# Altium project LED Driver.PrjPcb
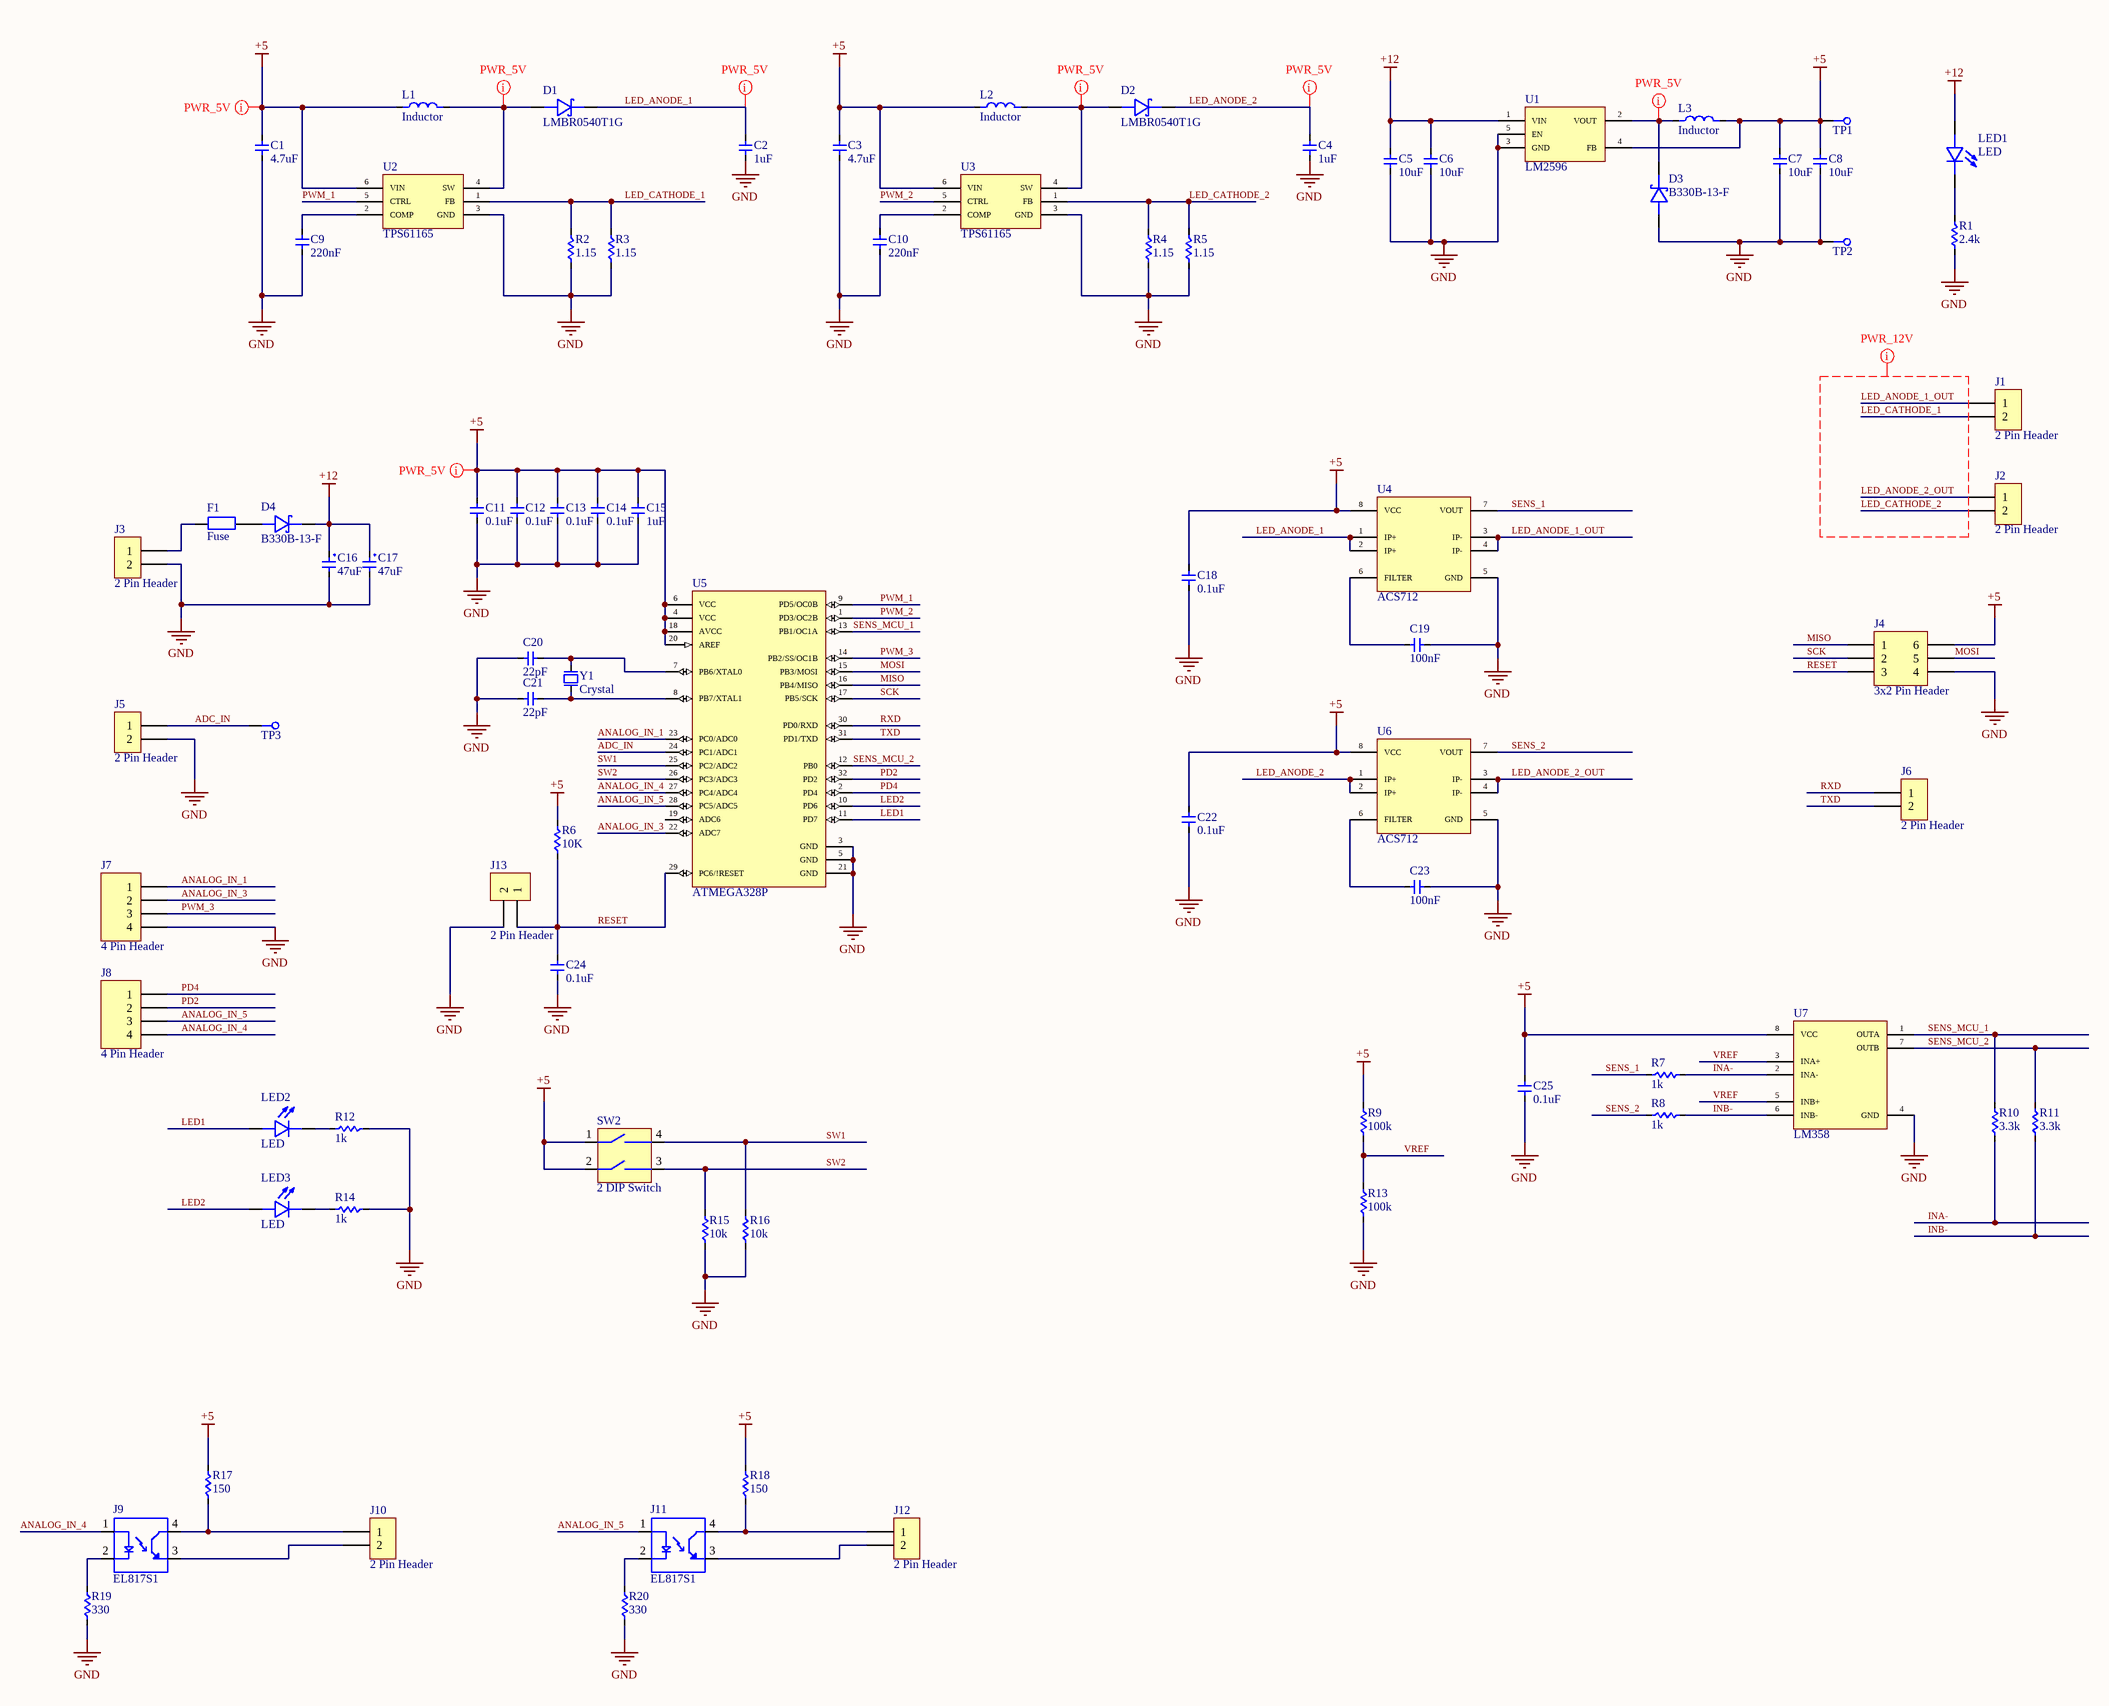
[diagram p0: LED Driver.SchDoc]
1 sheet, 81 parts. Net scope: global (net labels, ports and power ports of the same name join across sheets).
Board file: LED Driver PCB.PcbDoc

## Sheet LED Driver.SchDoc
size A2

### Parts
C1  4.7uF  [RES603]
C2  1uF  [RES603]
C3  4.7uF  [RES603]
C4  1uF  [RES603]
C5  10uF  [RES603]
C6  10uF  [RES603]
C7  10uF  [RES603]
C8  10uF  [RES603]
C9  220nF  [RES603]
C10  220nF  [RES603]
C11  0.1uF  [RES603]
C12  0.1uF  [RES603]
C13  0.1uF  [RES603]
C14  0.1uF  [RES603]
C15  1uF  [RES603]
C16  47uF  [VEJ470M1HTR-0607]
C17  47uF  [VEJ470M1HTR-0607]
C18  0.1uF  [RES603]
C19  100nF  [RES603]
C20  22pF  [RES603]
C21  22pF  [RES603]
C22  0.1uF  [RES603]
C23  100nF  [RES603]
C24  0.1uF  [RES603]
C25  0.1uF  [RES603]
D1  LMBR0540T1G  [LMBR0540T1G]
D2  LMBR0540T1G  [LMBR0540T1G]
D3  B330B-13-F  [B330B-13-F]
D4  B330B-13-F  [B330B-13-F]
F1  Fuse  [39215000000]
J1  2 Pin Header  [2POS 2.54mm Pin Header]
J2  2 Pin Header  [2POS 2.54mm Pin Header]
J3  2 Pin Header  [2POS 5.08mm Screw Connector]
J4  3x2 Pin Header  [2x3POS 2.54mm Pin Header]
J5  2 Pin Header  [2POS 2.54mm Pin Header]
J6  2 Pin Header  [2POS 2.54mm Pin Header]
J7  4 Pin Header  [4POS 2.54mm PIN Header]
J8  4 Pin Header  [4POS 2.54mm PIN Header]
J9  EL817S1  [EL817S1]
J10  2 Pin Header  [2POS 2.54mm Pin Header]
J11  EL817S1  [EL817S1]
J12  2 Pin Header  [2POS 2.54mm Pin Header]
J13  2 Pin Header  [2POS 5.08mm Screw Connector]
L1  Inductor  [CDRH104RNP-220NC]
L2  Inductor  [CDRH104RNP-220NC]
L3  Inductor  [CDRH104RNP-220NC]
LED1  LED  [LED603]
LED2  LED  [LED603]
LED3  LED  [LED603]
R1  2.4k  [RES805]
R2  1.15  [RES805]
R3  1.15  [RES805]
R4  1.15  [RES805]
R5  1.15  [RES805]
R6  10K  [RES603]
R7  1k  [RES603]
R8  1k  [RES603]
R9  100k  [RES603]
R10  3.3k  [RES603]
R11  3.3k  [RES603]
R12  1k  [RES805]
R13  100k  [RES603]
R14  1k  [RES805]
R15  10k  [RES603]
R16  10k  [RES603]
R17  150  [RES805]
R18  150  [RES805]
R19  330  [RES805]
R20  330  [RES805]
SW2  2 DIP Switch  [EM-02KP]
TP1  Test Point  [TP SMD]  (value not drawn)
TP2  Test Point  [TP SMD]  (value not drawn)
TP3  Test Point  [TP SMD]  (value not drawn)
U1  LM2596  [LM2596-TO263]
U2  TPS61165  [TPS611DRVR]
U3  TPS61165  [TPS611DRVR]
U4  ACS712  [SOIC127P600X175-8N]
U5  ATMEGA328P  [ATMEGA328P-AU]
U6  ACS712  [SOIC127P600X175-8N]
U7  LM358  [SOIC127P600X175-8N]
Y1  Crystal  [X503216MSB2GI]

### Nets
+5: C1.2 C3.2 C7.2 C8.2 C11.2 C12.2 C13.2 C14.2 C15.2 C18.2 C22.2 C25.2 J4.6 L1.1 L2.1 L3.2 R6.2 R9.2 R17.2 R18.2 SW2.1 SW2.2 TP1.1 U1.4(FB) U2.6(VIN) U3.6(VIN) U4.8(VCC) U5.4(VCC) U5.6(VCC) U5.18(AVCC) U5.20(AREF) U6.8(VCC) U7.8(VCC)
+12: C5.2 C6.2 C16.1 C17.1 D4.C LED1.A U1.1(VIN)
GND: C1.1 C2.1 C3.1 C4.1 C5.1 C6.1 C7.1 C8.1 C9.1 C10.1 C11.1 C12.1 C13.1 C14.1 C15.1 C16.2 C17.2 C18.1 C19.1 C20.2 C21.2 C22.1 C23.1 C24.1 C25.1 D3.A J3.2 J4.4 J5.2 J7.4 J13.2 R1.1 R2.1 R3.1 R4.1 R5.1 R12.2 R13.1 R14.2 R15.1 R16.1 R19.1 R20.1 TP2.1 U1.3(GND) U1.5(EN) U2.3(GND) U3.3(GND) U4.5(GND) U5.3(GND) U5.5(GND) U5.21(GND) U6.5(GND) U7.4(GND)
ADC_IN: J5.1 TP3.1 U5.24(PC1/ADC1)
ANALOG_IN_1: J7.1 U5.23(PC0/ADC0)
ANALOG_IN_3: J7.2 U5.22(ADC7)
ANALOG_IN_4: J8.4 J9.1(A) U5.27(PC4/ADC4)
ANALOG_IN_5: J8.3 J11.1(A) U5.28(PC5/ADC5)
INA-: R7.1 R10.2 U7.2(INA-)
INB-: R8.1 R11.2 U7.6(INB-)
LED1: LED2.A U5.11(PD7)
LED2: LED3.A U5.10(PD6)
LED_ANODE_1: C2.2 D1.C U4.1(IP+) U4.2(IP+)
LED_ANODE_1_OUT: J1.1 U4.3(IP-) U4.4(IP-)
LED_ANODE_2: C4.2 D2.C U6.1(IP+) U6.2(IP+)
LED_ANODE_2_OUT: J2.1 U6.3(IP-) U6.4(IP-)
LED_CATHODE_1: J1.2 R2.2 R3.2 U2.1(FB)
LED_CATHODE_2: J2.2 R4.2 R5.2 U3.1(FB)
MISO: J4.1 U5.16(PB4/MISO)
MOSI: J4.5 U5.15(PB3/MOSI)
PD2: J8.2 U5.32(PD2)
PD4: J8.1 U5.2(PD4)
PWM_1: U2.5(CTRL) U5.9(PD5/OC0B)
PWM_2: U3.5(CTRL) U5.1(PD3/OC2B)
PWM_3: J7.3 U5.14(PB2/SS/OC1B)
RESET: C24.2 J4.3 J13.1 R6.1 U5.29(PC6/!RESET)
RXD: J6.1 U5.30(PD0/RXD)
SCK: J4.2 U5.17(PB5/SCK)
SENS_1: R7.2 U4.7(VOUT)
SENS_2: R8.2 U6.7(VOUT)
SENS_MCU_1: R10.1 U5.13(PB1/OC1A) U7.1(OUTA)
SENS_MCU_2: R11.1 U5.12(PB0) U7.7(OUTB)
SW1: R16.2 SW2.4 U5.25(PC2/ADC2)
SW2: R15.2 SW2.3 U5.26(PC3/ADC3)
TXD: J6.2 U5.31(PD1/TXD)
VREF: R9.1 R13.2 U7.3(INA+) U7.5(INB+)
NetC9_2: C9.2 U2.2(COMP)
NetC10_2: C10.2 U3.2(COMP)
NetC19_2: C19.2 U4.6(FILTER)
NetC20_1: C20.1 U5.7(PB6/XTAL0) Y1.2
NetC21_1: C21.1 U5.8(PB7/XTAL1) Y1.1
NetC23_2: C23.2 U6.6(FILTER)
NetD1_A: D1.A L1.2 U2.4(SW)
NetD2_A: D2.A L2.2 U3.4(SW)
NetD3_C: D3.C L3.1 U1.2(VOUT)
NetD4_A: D4.A F1.2
NetF1_1: F1.1 J3.1
NetJ9_2: J9.2(C) R19.2
NetJ9_3: J9.3(ET) J10.2
NetJ9_4: J9.4(CT) J10.1 R17.1
NetJ11_2: J11.2(C) R20.2
NetJ11_3: J11.3(ET) J12.2
NetJ11_4: J11.4(CT) J12.1 R18.1
NetLED1_C: LED1.C R1.2
NetLED2_C: LED2.C R12.1
NetLED3_C: LED3.C R14.1

Not connected (* = marked no-connect by the designer): U5 19(ADC6)

### Layout directives
rule Width Constraint [Pref Width = 30mil    Min Width = 10mil    Max Width = 40mil]; net class LED_Current: +5, LED_ANODE_1, LED_ANODE_1_OUT, LED_ANODE_2, LED_ANODE_2_OUT, LED_CATHODE_1, LED_CATHODE_2, NetD1_A, NetD2_A
rule Width Constraint [Pref Width = 30mil    Min Width = 10mil    Max Width = 40mil]: +5
mark named PWR_5V: NetD3_C

### Notes on the sheet
- Title
- Size:
- Date:
- File:
- A2
- Number:
- Time:
- Revision:
- Sheet
- of

### Library data of the parts
C1-C15 C18-C25 = Capacitor
C16 C17 = Cap Pol
D1-D4 = Schottky Diode
R1-R20 = Resistor